# Altium schematic sheet lv_io_solenoid_ctl.SchDoc
size A4; Organization: Badgerloop; Address1: 133 Engineering Research; Address2: Building; Address3: Madison, WI 53715
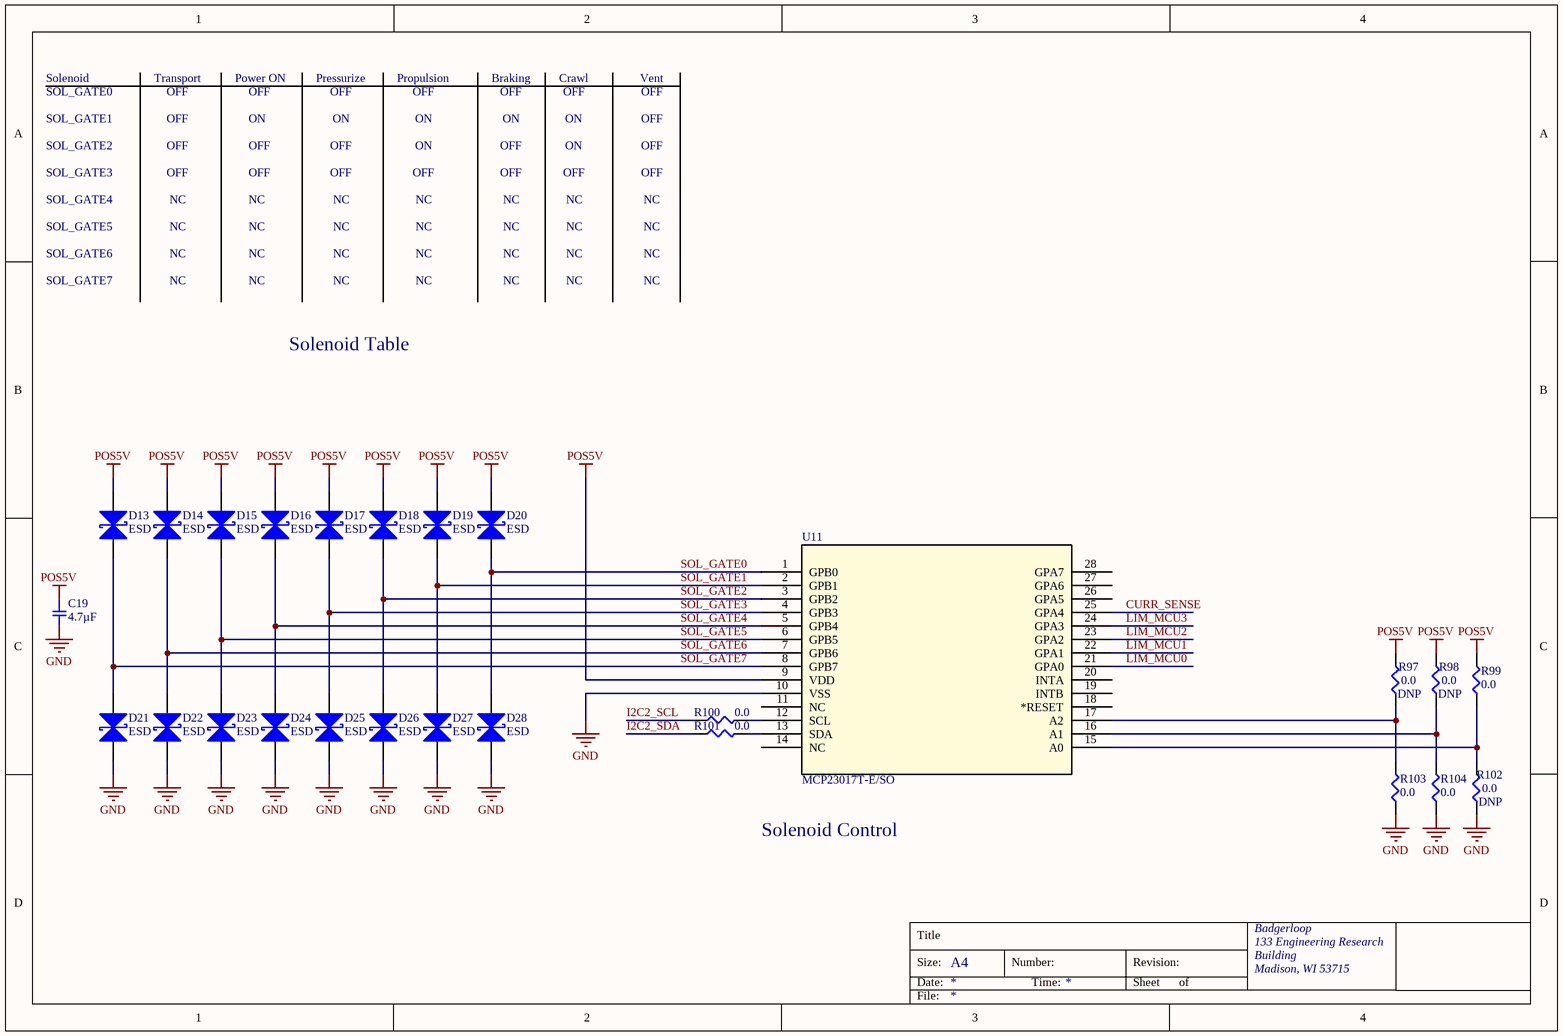
[diagram p0: lv_io_solenoid_ctl.SchDoc]

## Parts
C19  4.7µF  [SMD-0805C]
D13  ESD  [SMD-0402-RES]
D14  ESD  [SMD-0402-RES]
D15  ESD  [SMD-0402-RES]
D16  ESD  [SMD-0402-RES]
D17  ESD  [SMD-0402-RES]
D18  ESD  [SMD-0402-RES]
D19  ESD  [SMD-0402-RES]
D20  ESD  [SMD-0402-RES]
D21  ESD  [SMD-0402-RES]
D22  ESD  [SMD-0402-RES]
D23  ESD  [SMD-0402-RES]
D24  ESD  [SMD-0402-RES]
D25  ESD  [SMD-0402-RES]
D26  ESD  [SMD-0402-RES]
D27  ESD  [SMD-0402-RES]
D28  ESD  [SMD-0402-RES]
R97  0.0  [SMD-0402-RES]
R98  0.0  [SMD-0402-RES]
R99  0.0  [SMD-0402-RES]
R100  0.0  [SMD-0402-RES]
R101  0.0  [SMD-0402-RES]
R102  0.0  [SMD-0402-RES]
R103  0.0  [SMD-0402-RES]
R104  0.0  [SMD-0402-RES]
U11  MCP23017T-E/SO  [SOIC28-W_MC-M]

## Nets
GND: C19.2 D21.1(A) D22.1(A) D23.1(A) D24.1(A) D25.1(A) D26.1(A) D27.1(A) D28.1(A) R102.1 R103.1 R104.1 U11.10(VSS)
POS5V: C19.1 D13.2(K) D14.2(K) D15.2(K) D16.2(K) D17.2(K) D18.2(K) D19.2(K) D20.2(K) R97.2 R98.2 R99.2 U11.9(VDD)
CURR_SENSE: U11.25(GPA4)
I2C2_SCL: R100.1
I2C2_SDA: R101.1
LIM_MCU0: U11.21(GPA0)
LIM_MCU1: U11.22(GPA1)
LIM_MCU2: U11.23(GPA2)
LIM_MCU3: U11.24(GPA3)
SOL_GATE0: D20.1(A) D28.2(K) U11.1(GPB0)
SOL_GATE1: D19.1(A) D27.2(K) U11.2(GPB1)
SOL_GATE2: D18.1(A) D26.2(K) U11.3(GPB2)
SOL_GATE3: D17.1(A) D25.2(K) U11.4(GPB3)
SOL_GATE4: D16.1(A) D24.2(K) U11.5(GPB4)
SOL_GATE5: D15.1(A) D23.2(K) U11.6(GPB5)
SOL_GATE6: D14.1(A) D22.2(K) U11.7(GPB6)
SOL_GATE7: D13.1(A) D21.2(K) U11.8(GPB7)
NetR97_1: R97.1 R103.2 U11.17(A2)
NetR98_1: R98.1 R104.2 U11.16(A1)
NetR99_1: R99.1 R102.2 U11.15(A0)
NetR100_2: R100.2 U11.12(SCL)
NetR101_2: R101.2 U11.13(SDA)

Not connected (* = marked no-connect by the designer): U11 11(NC) 14(NC) 18(*RESET) 19(INTB) 20(INTA) 26(GPA5) 27(GPA6) 28(GPA7)

## Notes on the sheet
- SOL_GATE0
- Solenoid
- Transport
- OFF
- Power ON
- Pressurize
- Propulsion
- Braking
- Crawl
- Vent
- SOL_GATE1
- SOL_GATE2
- SOL_GATE3
- ON
- SOL_GATE4
- SOL_GATE5
- NC
- SOL_GATE6
- SOL_GATE7
- Solenoid Table
- Solenoid Control
- Title
- Size:
- Date:
- A4
- Number:
- Time:
- Revision:
- Sheet
- of
- File:

## Library data of the parts
C19 = GRM21BR60J475KA11L: CAP CER 4.7UF 6.3V X5R 0805; Manufacturer: Murata Electronics North America; Factory Stock: 0; Unit Price (USD): 0.28; Minimum Quantity: 1; Tolerance: ±10%; Datasheets: http://www.murata.com/~/media/webrenewal/support/library/catalog/products/capacitor/mlcc/c02e.pdf; Image: //media.digikey.com/Renders/Murata%20Renders/0805%20(2012%20Metric)%20.85mm.jpg; Digi-Key Part Number: 490-9749-1-ND; Part Number: GRM21BR60J475KA11L; Quantity Available: 2821; @ qty: 0; Packaging: Cut Tape (CT); Series: GRM; Part Status: Active; Value: 4.7µF; Voltage: 6.3V; Temperature Coefficient: X5R; Operating Temperature: -55°C ~ 85°C; Features: -; Ratings: -; Applications: General Purpose; Mounting Type: Surface Mount, MLCC; Package / Case: 0805 (2012 Metric); Size / Dimension: 0.079" L x 0.049" W (2.00mm x 1.25mm); Height - Seated (Max): -; Thickness (Max): 0.055" (1.40mm); Lead Spacing: -; Lead Style: -
D13-D28 = ESD Diode: ESD Supressor; Manufacturer P/N: Panasonic; Manufacturer: EZAEG; Digikey P/N: P13571CT-ND; Digikey Link: https://www.digikey.com/product-detail/en/panasonic-electronic-components/EZA-EG2A50AX/P13571CT-ND/1137239
R97-R104 = ERJ-2GE0R00X: RES SMD 0.0OHM JUMPER 1/10W 0402; Manufacturer: Panasonic Electronic Components; Factory Stock: 0; Unit Price (USD): 0.00384; @ qty: 1500; Minimum Quantity: 1; Power (Watts): 0.1W, 1/10W; Part Number: ERJ-2GE0R00X; Datasheets: http://industrial.panasonic.com/www-cgi/jvcr13pz.cgi?E+PZ+3+AOA0001+ERJ2GE0R00X+7+WW; Image: //media.digikey.com/Photos/Panasonic%20Photos/ERJ-PA2-Series.jpg; Digi-Key Part Number: P0.0JCT-ND; Quantity Available: 3152483; Packaging: Cut Tape (CT); Series: ERJ; Part Status: Active; Value: 0.0; Tolerance: Jumper; Composition: Thick Film; Features: Automotive AEC-Q200; Temperature Coefficient: -; Operating Temperature: -55°C ~ 155°C; Package / Case: 0402 (1005 Metric); Supplier Device Package: 0402; Size / Dimension: 0.039" L x 0.020" W (1.00mm x 0.50mm); Height - Seated (Max): 0.016" (0.40mm); Number of Terminations: 2; Failure Rate: -
  R97 R98 R102: DNP: DNP
  R99 R103 R104: DNP: *
U11 = MCP23017T-E/SO: IC I/O EXPANDER I2C 16B 28SOIC; Manufacturer: Microchip; Manufacturer P/N: MCP23017T-E/SO; Digikey P/N: MCP23017T-E/SOCT-ND; Digikey Link: https://www.digikey.com/product-detail/en/microchip-technology/MCP23017T-E-SO/MCP23017T-E-SOCT-ND/5358289